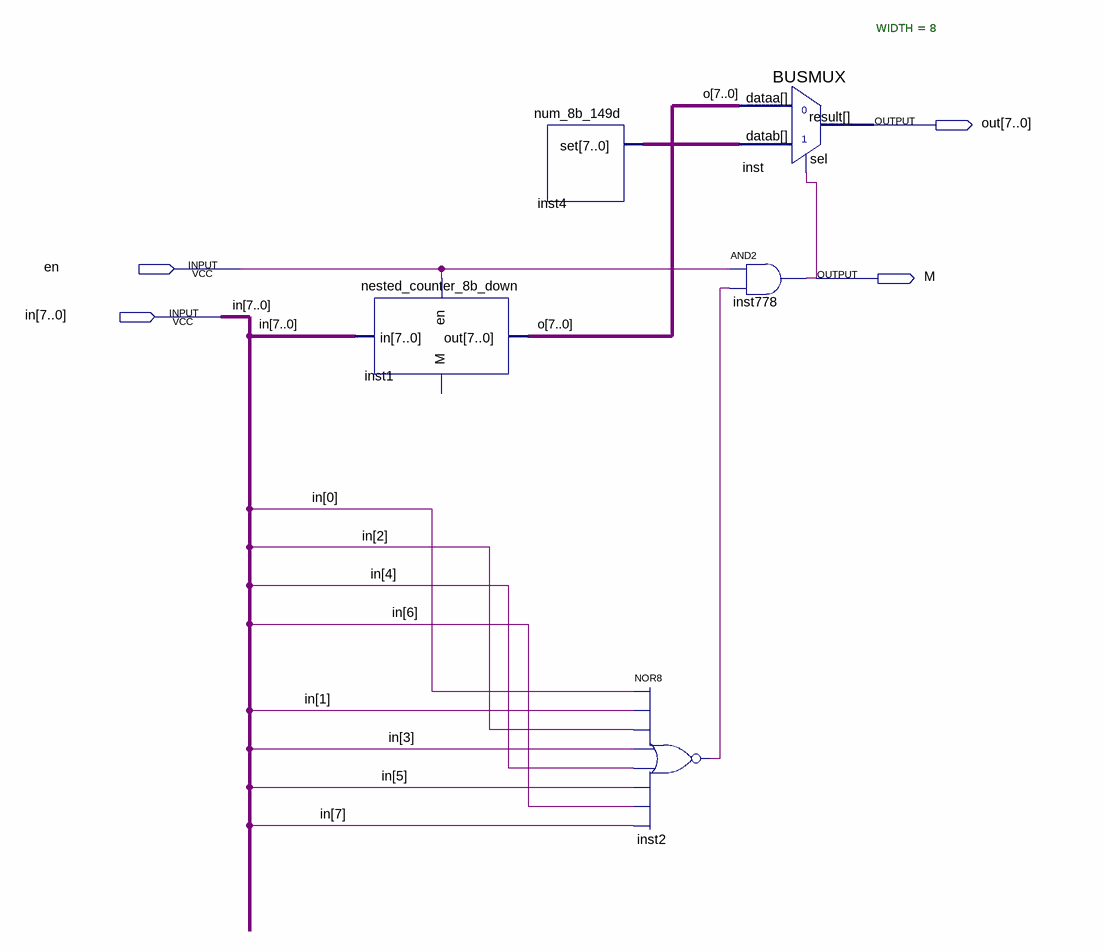
[diagram p0: schematic sheet]
// Quartus schematic nested_counter_150d_down.bdf as structural Verilog: 5 symbols, 4 pins
module nested_counter_150d_down (
  input  en,
  input  [7:0] in,
  output [7:0] out,
  output M
);

  wire inst2_out;
  wire [7:0] inst4_set, o;

  nested_counter_8b_down inst1 (.en(en), .in(in), .out(o));  // open: M
  num_8b_149d inst4 (.set(inst4_set));
  nor inst2 (inst2_out, in[0], in[1], in[2], in[3], in[4], in[5], in[6], in[7]);
  and inst778 (M, en, inst2_out);
  BUSMUX #(.WIDTH(8)) inst (.datab(inst4_set), .sel(M), .dataa(o), .result(out));
endmodule
